# EAGLE design End_stop (EAGLE 6.5.0)
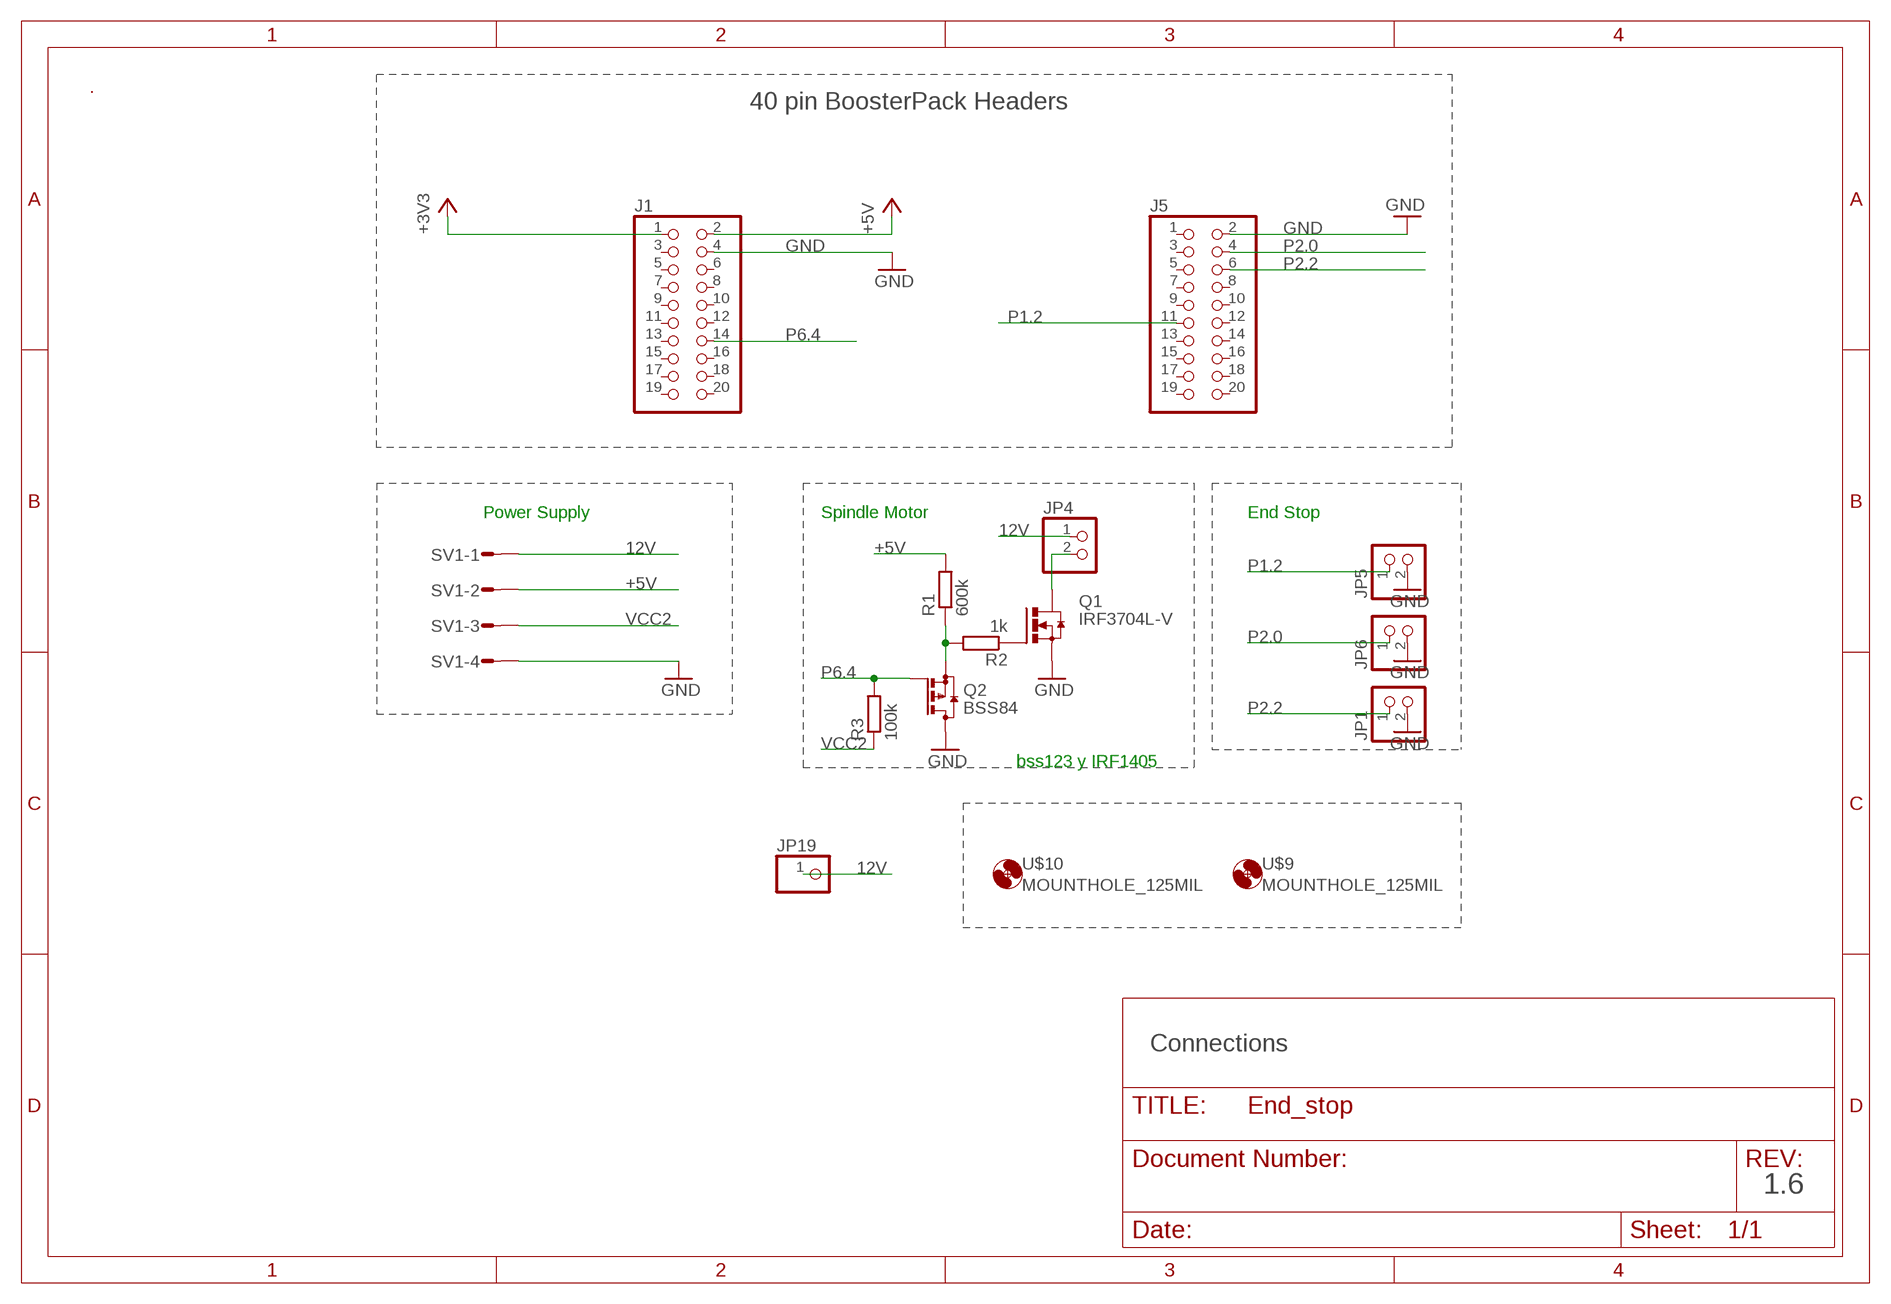
[diagram p0: schematic, sheet 1]

## Parts
J1  PINHD-2X10  [2X10]
J5  PINHD-2X10  [2X10]
JP1  PINHD-1X2  [1X02]
JP4  PINHD-1X2  [1X02]
JP5  PINHD-1X2  [1X02]
JP6  PINHD-1X2  [1X02]
JP19  PINHD-1X1  [1X01]
Q1  IRF3704L-V  [TO262-V]
Q2  BSS84  [SOT23]
R1  600k  R-EU_R0603  [R0603]
R2  1k  R-EU_R0603  [R0603]
R3  100k  R-EU_R0603  [R0603]
SV1  MT6-4  [MT6-4]
U$4  MS_TM  [MS_TM]
U$9  MOUNTHOLE_125MIL  [MOUNTHOLE_125MIL]
U$10  MOUNTHOLE_125MIL  [MOUNTHOLE_125MIL]

## Nets
12V: JP4.1 JP19.1 SV1.1
+5V [Power]: J1.2 R1.2 SV1.2
GND [Ground]: J1.4 J5.2 JP1.2 JP5.2 JP6.2 Q1.3(S) Q2.3(D) SV1.4
N$1: JP4.2 Q1.2(D)
N$3: Q1.1(G) R2.1
N$4: Q2.2(S) R1.1 R2.2
P1.2: J5.11 JP5.1
P2.0: J5.4 JP6.1
P2.2: J5.6 JP1.1
P6.4: J1.14 Q2.1(G) R3.2
VCC2: J1.1 R3.1 SV1.3 ; supply symbol labelled +3V3
Unconnected: J1.3 J1.5 J1.6 J1.7 J1.8 J1.9 J1.10 J1.11 J1.12 J1.13 J1.15 J1.16 J1.17 J1.18 J1.19 J1.20 J5.1 J5.3 J5.5 J5.7 J5.8 J5.9 J5.10 J5.12 J5.13 J5.14 J5.15 J5.16 J5.17 J5.18 J5.19 J5.20

## Notes on the sheet
- 40 pin BoosterPack Headers
- Power Supply | Spindle Motor | End Stop
- bss123 y IRF1405
- Connections
- 1.6

## Library data of the parts
J1 J5 = pinhead:PINHD-2X10: PIN HEADER
JP1 JP4-JP6 = pinhead:PINHD-1X2: PIN HEADER
JP19 = pinhead:PINHD-1X1: PIN HEADER
Q1 = transistor-power:IRF3704: SMPS MOSFET HEXFET® Power MOSFET Source: http://www.irf.com/product-info/datasheets/data/irf3704.pdf
Q2 = transistor-small-signal:BSS84: P-CHANNEL MOS FET
R1-R3 = rcl:R-EU_: RESISTOR, European symbol
SV1 = con-amp-mt6:MT6-4: AMP MT6 CONNECTOR; OC_FARNELL: unknown; OC_NEWARK: unknown
U$4 = LP_Silkscreen:MS_TM
U$9 U$10 = MSP-EXP432:MOUNTHOLE_125MIL

## Net classes
0 Default: width 0.203 mm, drill 0.838 mm, clearance 0.254 mm
1 Ground: width 0.203 mm, drill 0.838 mm, clearance 0.254 mm to class 0, clearance 0.152 mm
2 Power: width 0.381 mm, drill 0.838 mm, clearance 0.254 mm to class 0, clearance 0.152 mm to class 1, clearance 0.152 mm

## Board
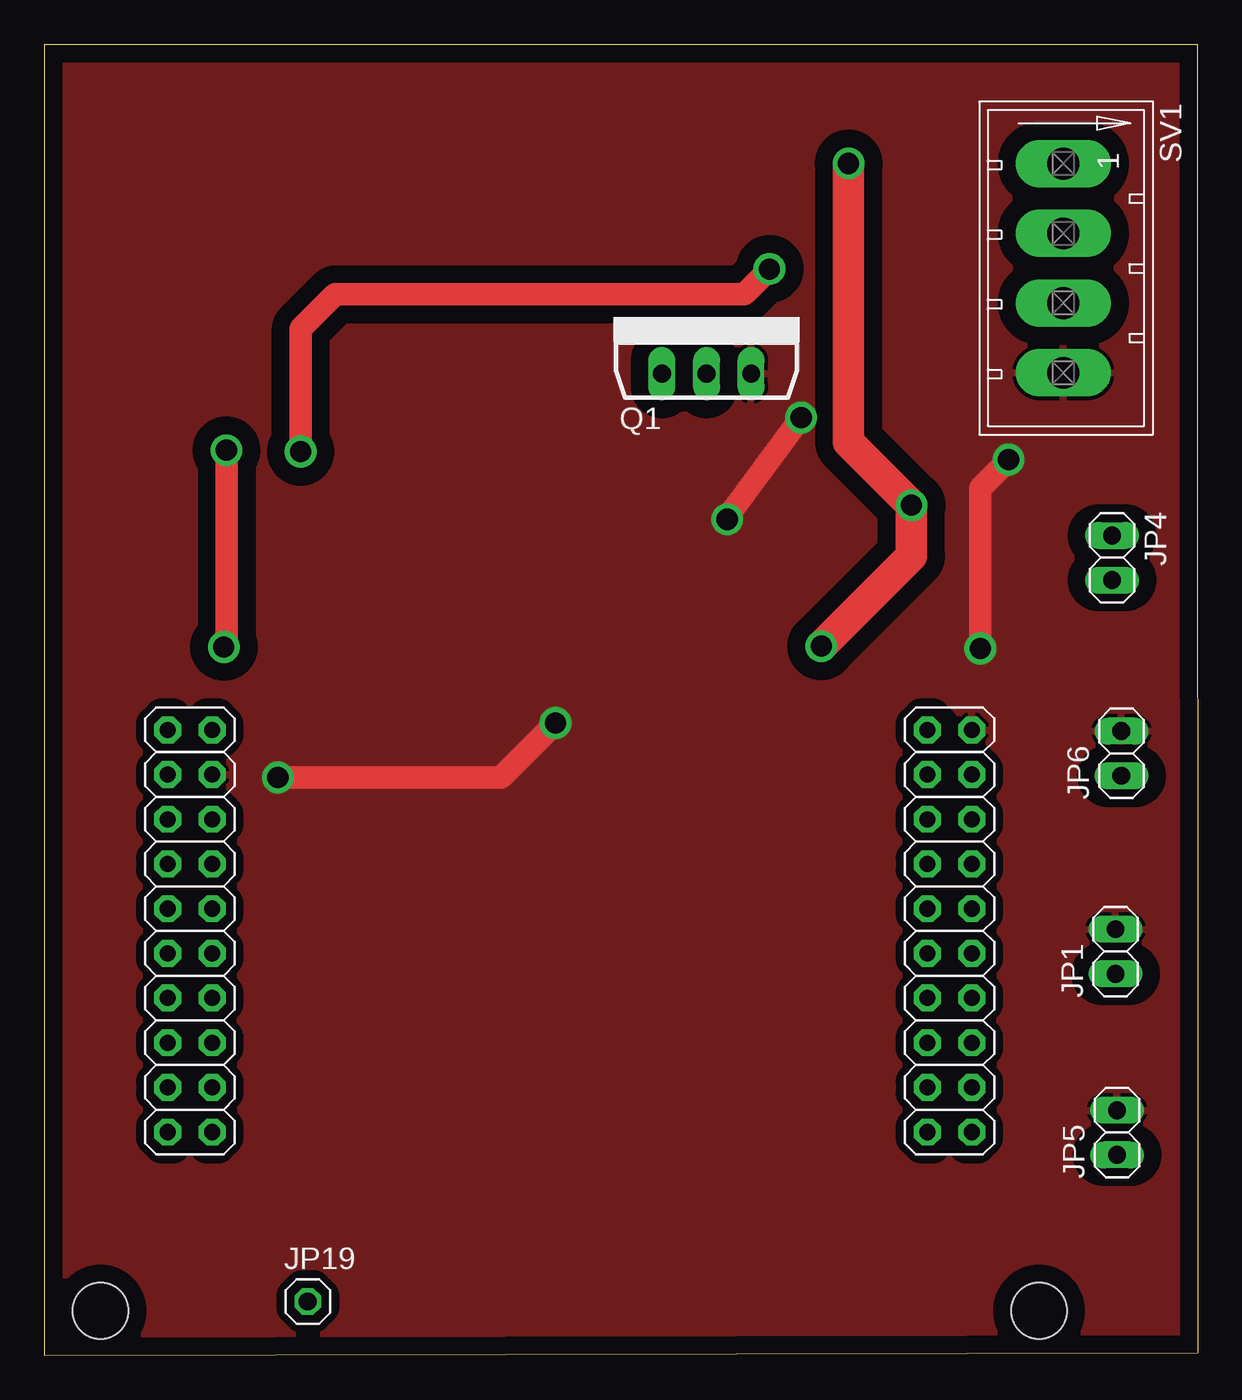
[diagram p1: board, top side]
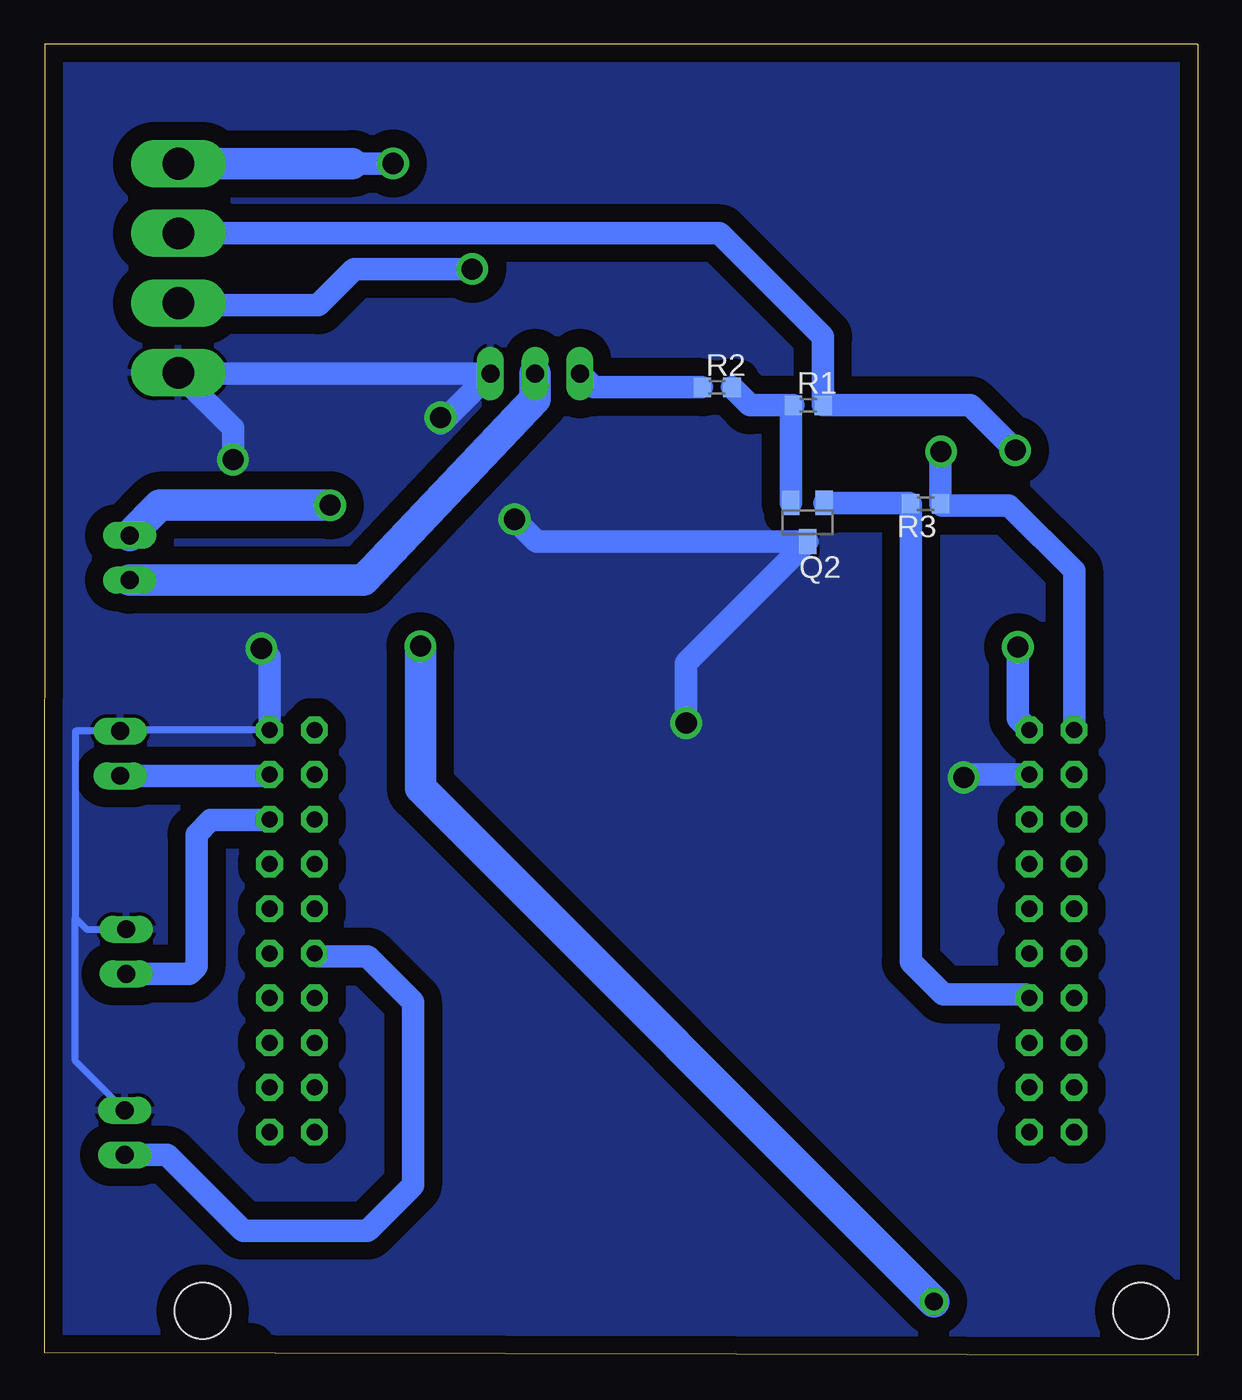
[diagram p2: board, bottom side, seen from below]

Size 65.58 x 74.55 mm. Coordinates in mm from the lower left corner, seen from the top.
Outline: 0,0 65.58,0.15 65.55,74.55 0.02,74.55 0,74.55 0,0
Copper layers (1*16): Top 0.0178mm / dielectric 12mil / Bottom 0.0178mm
Design rules "default": minimum track width 6mil, minimum drill 12mil, track to track 6mil, track to pad 6mil, pad to pad 6mil, via to via 8mil, smd to smd 6mil, copper to edge 8mil, drill to drill 8mil, minimum pad ring 10mil, minimum via ring 8mil, stop-mask expansion 8mil, vias tented up to drill 15mil, thermal gap 8mil

### Footprints (pad centres in the part's own frame; a part is rotated, then mirrored left to right if it is on the bottom)
2X10 = drill 0.914 pad 1.524 octagon: 1 -11.43,-1.27; 2 -11.43,1.27; 3 -8.89,-1.27; 4 -8.89,1.27; 5 -6.35,-1.27; 6 -6.35,1.27; 7 -3.81,-1.27; 8 -3.81,1.27; 9 -1.27,-1.27; 10 -1.27,1.27; 11 1.27,-1.27; 12 1.27,1.27; 13 3.81,-1.27; 14 3.81,1.27; 15 6.35,-1.27; 16 6.35,1.27; 17 8.89,-1.27; 18 8.89,1.27; 19 11.43,-1.27; 20 11.43,1.27
1X02 = drill 1.016 long: 1 -1.27,0; 2 1.27,0
1X01 = drill 1.016 octagon: 1 0,0
TO262-V = drill 1.016 long: 1 -2.54,0; 2 0,0; 3 2.54,0
SOT23 = smd 1 x 1.4: 1 -0.95,-1.1; 2 0.95,-1.1; 3 0,1.1
R0603 = smd 1 x 1.1: 1 -0.85,0; 2 0.85,0
MT6-4 = drill 1.803 long: 1 2.54,0; 2 6.502,0; 3 10.465,0; 4 14.427,0
MOUNTHOLE_125MIL = hole 3.175: 0,0

### Placement (x,y rotation side)
J1  8.29,24.13 270 top
J5  51.47,24.13 270 top
JP1  60.91,22.96 90 top
JP4  60.71,45.34 270 top
JP5  60.99,12.67 90 top
JP6  61.25,34.22 90 top
JP19  15,3.07 0 top
Q1  37.66,55.81 0 top
Q2  22.18,47.36 180 bottom
R1  22.14,54.02 0 bottom
R2  27.32,55.03 0 bottom
R3  15.47,48.4 180 bottom
SV1  57.94,70.29 270 top
U$4  53.4,0.36 0 top
U$9  56.55,2.54 0 top
U$10  3.21,2.54 0 top

### Tracks (layer width: path | path; a pad name or v marks a point on that pad's centre or on a via)
12V  (via drill 1.2)
  Top 1.778: v45.73,67.75 45.73,51.91 v49.31,48.33 49.31,45.45 v44.18,40.32
  Bottom 1.27: 48.05,67.75 v45.73,67.75
  Bottom 1.778: SV1.1 48.05,67.75 | v49.31,48.33 58.99,48.33 JP4.1 | JP19.1 44.18,32.25 v44.18,40.32
+5V  (via drill 1.2)
  Top 1.27: v10.37,51.45 10.37,40.42 v10.22,40.27
  Bottom 1.27: SV1.2 27.17,63.78 21.29,57.9 R1.2 12.93,54.02 v10.37,51.45 | v10.22,40.27 10.22,36.22 J1.2
GND  (via drill 1.2)
  Top 1.27: v13.3,32.85 25.97,32.85 v29.07,35.95 | v38.83,47.53 38.83,47.62 v43.04,53.31 | v54.83,50.93 53.22,49.32 v53.22,40.19
  Bottom 0.406: J5.2 61.25,35.56 JP6.2 63.8,35.49 63.8,25.02 63.8,24.87 | 63.8,24.87 63.16,24.23 JP1.2 | JP5.2 63.8,16.75 63.8,24.87
  Bottom 1.27: 57.94,55.81 Q1.3 43.04,52.97 v43.04,53.31 | 57.94,55.81 SV1.4 | J1.4 13.13,33.02 v13.3,32.85 | v29.07,35.95 29.07,39.37 Q2.3 37.57,46.26 v38.83,47.53 | 57.94,55.81 54.83,52.7 v54.83,50.93 | v53.22,40.19 52.74,39.71 J5.2
  pour Top (isolate 1.016): 65.83,74.09 65.83,0 0.2,0 -0.01,74.63
  pour Bottom (isolate 1.016): 66.1,74.63 66.1,0.27 -0.07,0.27 -0.07,74.36
N$1
  Bottom 1.778: Q1.2 37.66,54.37 47.4,44.09 JP4.2
N$3
  Bottom 1.27: R2.1 34.34,55.03 Q1.1
N$4
  Bottom 1.27: Q2.2 23.13,53.88 R1.1 25.46,54.02 R2.2
P1.2
  Bottom 1.27: J5.11 50.03,22.68 47.19,22.68 44.61,20.11 44.61,9.67 47.19,7.09 54.27,7.09 58.58,11.4 JP5.1
P2.0
  Bottom 1.27: J5.4 52.81,32.95 JP6.1
P2.2
  Bottom 1.27: J5.6 52.79,30.43 56.1,30.43 56.9,29.63 56.9,22.11 57.32,21.69 JP1.1
P6.4
  Bottom 1.27: Q2.1 16.38,48.46 R3.2 16.32,22.38 14.47,20.53 9.78,20.53 J1.14
VCC2  (via drill 1.2)
  Top 1.27: v14.59,51.38 14.59,58.36 16.56,60.33 39.81,60.33 v41.24,61.76
  Bottom 1.27: J1.1 7.02,44.6 10.74,48.32 14.54,48.32 R3.1 14.62,51.35 v14.59,51.38 | v41.24,61.76 47.94,61.76 50,59.7 57.82,59.7 SV1.3